# Altium schematic sheet Tractian_Challenge_v1.SchDoc
size A4
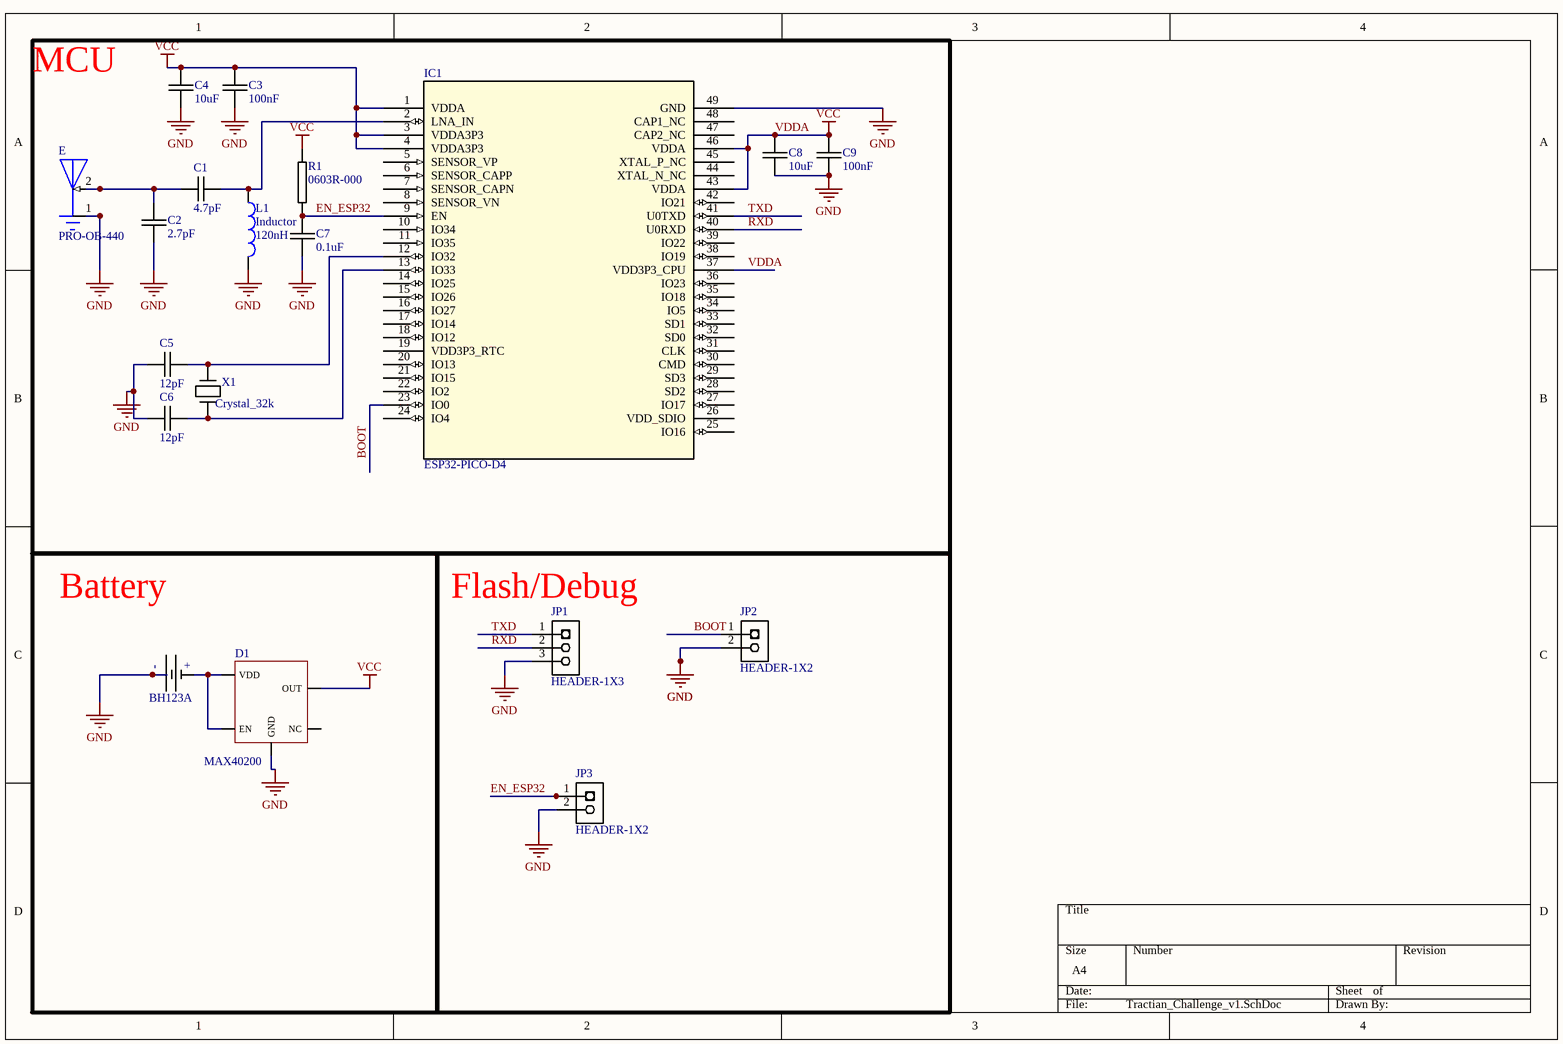
[diagram p0: Tractian_Challenge_v1.SchDoc]

## Parts
BAT?  BH123A  [BH123A]
C1  4.7pF  [0603C-GENERIC]
C2  2.7pF  [0603C-GENERIC]
C3  100nF  [0603C-GENERIC]
C4  10uF  [0603C-GENERIC]
C5  12pF  [0603C-GENERIC]
C6  12pF  [0603C-GENERIC]
C7  0.1uF  [0603C-GENERIC]
C8  10uF  [0603C-GENERIC]
C9  100nF  [0603C-GENERIC]
D1  MAX40200  [SOT23-MAX40200]
E  PRO-OB-440  [ANT_PRO-OB-440]
IC1  ESP32-PICO-D4  [ESP32-PICO-D4_EXP]
JP1  HEADER-1X3  [HEADER-1X3]
JP2  HEADER-1X2  [HEADER-1X2]
JP3  HEADER-1X2  [HEADER-1X2]
L1  Inductor  value 120nH  [INDC1608L]
R1  0603R-000  [0603R-GENERIC]
X1  Crystal_32k  [Crystal_32K_9pF]

## Blocks framed on the sheet
MCU: C1-C9 E IC1 L1 R1 X1
Battery: BAT? D1
Flash/Debug: JP1-JP3

## Nets
GND: BAT?.1(+) C2.1 C3.1 C4.1 C5.1 C6.1 C7.2 C8.1 C9.1 D1.2(GND) E.1(GND) IC1.49(GND) JP1.3 JP2.2 JP3.2 L1.2
VDDA: C3.2 C4.2 C8.2 C9.2 D1.5(OUT) IC1.1(VDDA) IC1.3(VDDA3P3) IC1.4(VDDA3P3) IC1.37(VDD3P3_CPU) IC1.43(VDDA) IC1.46(VDDA) R1.1  [also labelled VCC]
BOOT: IC1.23(IO0) JP2.1
EN_ESP32: C7.1 IC1.9(EN) JP3.1 R1.2
RXD: IC1.40(U0RXD) JP1.2
TXD: IC1.41(U0TXD) JP1.1
NetBAT?_2: BAT?.2(+) D1.1(VDD) D1.3(EN)
NetC1_1: C1.1 C2.2 E.2(FEED)
NetC1_2: C1.2 IC1.2(LNA_IN) L1.1
NetC5_2: C5.2 IC1.12(IO32) X1.1
NetC6_2: C6.2 IC1.13(IO33) X1.4

Not connected (* = marked no-connect by the designer): D1 4(NC); IC1 5(SENSOR_VP) 6(SENSOR_CAPP) 7(SENSOR_CAPN) 8(SENSOR_VN) 10(IO34) 11(IO35) 14(IO25) 15(IO26) 16(IO27) 17(IO14) 18(IO12) 19(VDD3P3_RTC) 20(IO13) 21(IO15) 22(IO2) 24(IO4) 25(IO16) 26(VDD_SDIO) 27(IO17) 28(SD2) 29(SD3) 30(CMD) 31(CLK) 32(SD0) 33(SD1) 34(IO5) 35(IO18) 36(IO23) 38(IO19) 39(IO22) 42(IO21) 44(XTAL_N_NC) 45(XTAL_P_NC) 47(CAP2_NC) 48(CAP1_NC)

## Notes on the sheet
- (in symbol BH123A) -

## Library data of the parts
BAT? = BH123A: Suporte de Bateria CR123A; Manufacturer Part Number: BH123A; IDNEOC: *
C1-C4 C8 C9 = 0603C-33PF-50V-C0G-PAN: CAPACITOR 0603 CERAMIC; Manufacturer Part Number: CL10C0R5BB8ANNC; Reel: C42; IDNEOC: CCA0124
C5 = 0603C-000: CAPACITOR 0603 CERAMIC; Manufacturer Part Number: 251R14S8R2CV4T; TYPE: NPO OR COG; IDNEOC: CCA0095
C6 = 0603C-000: CAPACITOR 0603 CERAMIC; Manufacturer Part Number: 251R14S8R2CV4T; Type: NPO OR COG; IDNEOC: CCA0095
C7 = 0603C-000: CAPACITOR 0603 CERAMIC
D1 = MAX40200: Ultra-Tiny Micropower, 1A Ideal Diode with Ultra-Low Voltage Drop; IDNEOC: CDI0103; Manufacturer Part Number: MAX40200
E = PRO-OB-440: 2.4GHz Bluetooth, WirelessHART, WLAN, Zigbeeâ„¢ Stamped Metal RF Antenna 2.4GHz ~ 2.5GHz Solder Surface Mount; MF: Proant AB; MP: PRO-OB-440; SnapEDA_Link: https://www.snapeda.com/parts/PRO-OB-440/Proant%20AB/view-part/2307534/?ref=snap; Digi-Key_Purchase_URL: https://www.digikey.com/product-detail/en/proant-ab/PRO-OB-440/1532-1001-1-ND/4895684?utm_source=snapeda&utm_medium=aggregator&utm_campaign=symbol; Value: *; Package: None; Digi-Key_Part_Number: 1532-1001-1-ND
IC1 = ESP32-PICO-D4: No Description Available; Mfr_Name: Espressif Systems; Copyright: Copyright (C) 2022 Ultra Librarian. All rights reserved.; Manufacturer_Part_Number: ESP32-PICO-D4; RefDes: RefDes; Type: DEV
JP1 = HEADER-1X3: Manufacturer Part Number: .; Supplier 1: Digi-Key; Supplier Part Number 1: S1011E-36-ND; IDNEOC: .
JP2 = HEADER-1X2: Manufacturer Part Number: .; REEL: TH; Supplier 1: Digi-Key; Supplier Part Number 1: S1011E-36-ND; IDNEOC: .
JP3 = HEADER-1X2: REEL: TH; Supplier 1: Digi-Key; Supplier Part Number 1: S1011E-36-ND
L1 = Inductor: FIXED IND 120NH 300MA 650 MOHM; Manufacturer Part Number: PE-0603CDR12JTT; Code_IEC: 1005; IDNEOC: CIN0023; Published: 8-Jun-2000; LatestRevisionDate: 29-May-2009; LatestRevisionNote: IPC-7351 Footprint Added.; PackageReference: 0402-A; Publisher: Altium Limited; PackageDescription: Chip Inductor; Code_JEITA: 0402
R1 = 0603R-000: GENERIC RESISTOR 0603
X1 = Crystal_32k: Manufacturer Part Number: ABS07-32.768KHZ-7-T; IDNEOC: *